# Altium project 1.蓝牙小车大工程.PrjPCB
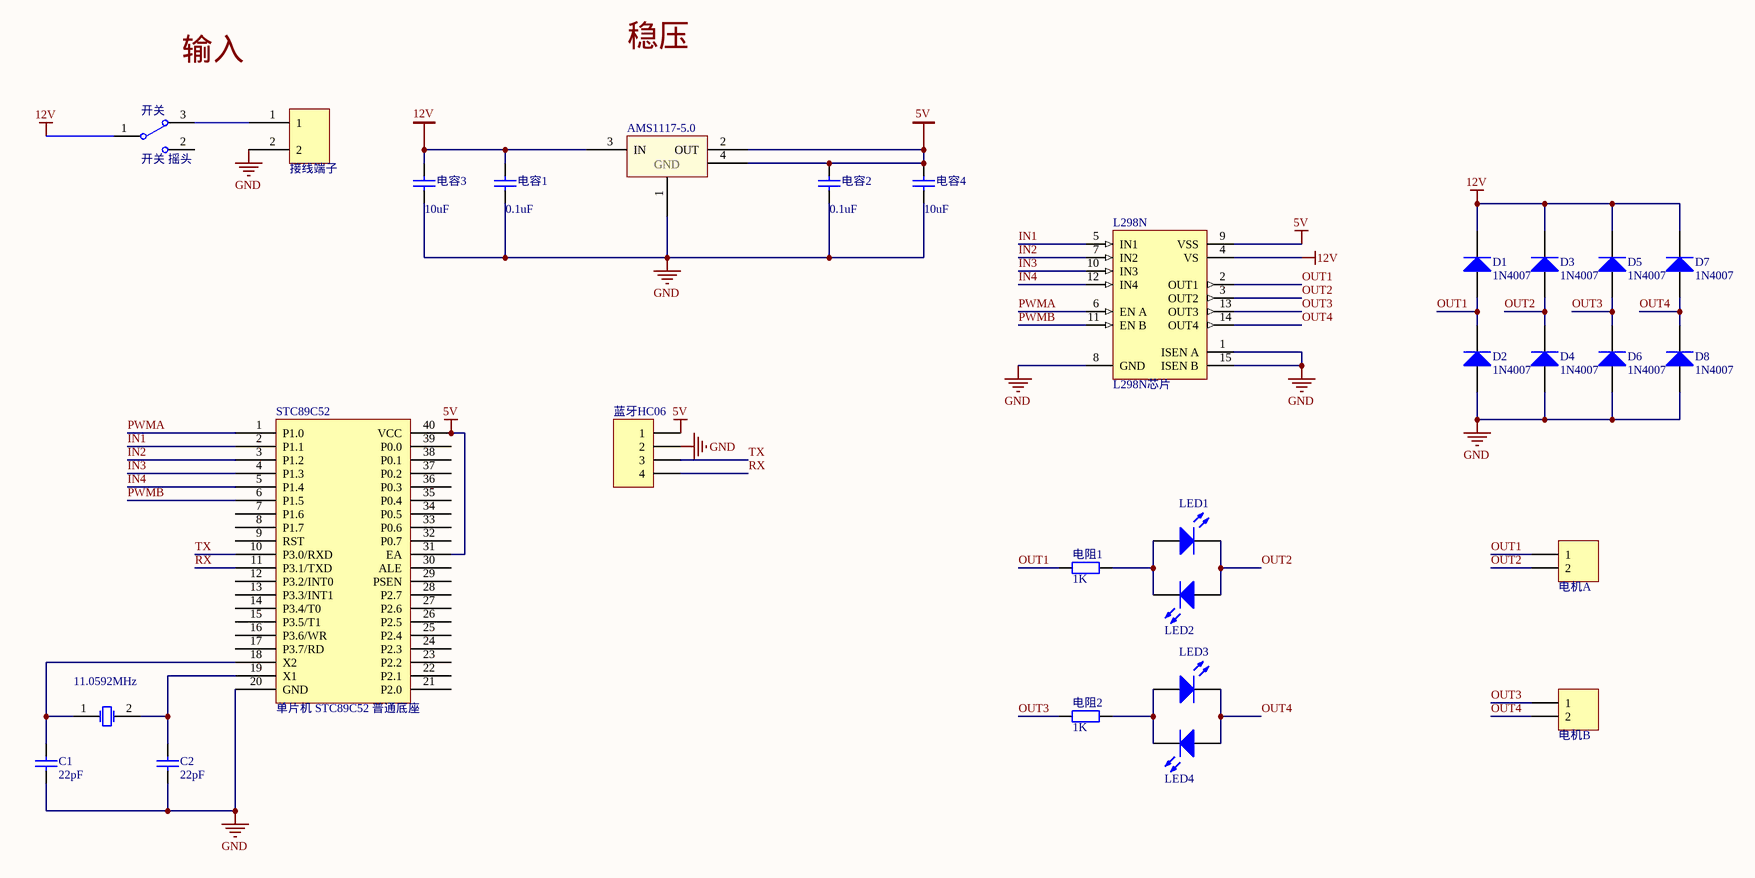
[diagram p0: 2.蓝牙小车原理图.SchDoc]
1 sheet, 29 parts. Net scope: global (net labels, ports and power ports of the same name join across sheets).
Board file: 3.蓝牙小车封装图.PcbDoc

## Sheet 2.蓝牙小车原理图.SchDoc
size A3

### Parts
AMS1117-5.0  稳压芯片 AMS1117  [稳压芯片 AMS1117]  (value not drawn)
C1  22pF  [电容 无极 贴片 0805]
C2  22pF  [电容 无极 贴片 0805]
D1  1N4007  [二极管 4007整流]
D2  1N4007  [二极管 4007整流]
D3  1N4007  [二极管 4007整流]
D4  1N4007  [二极管 4007整流]
D5  1N4007  [二极管 4007整流]
D6  1N4007  [二极管 4007整流]
D7  1N4007  [二极管 4007整流]
D8  1N4007  [二极管 4007整流]
L298N  L298N芯片  [L298N芯片]
LED1  LED 灯直径5mm  [LED 灯直径5mm]  (value not drawn)
LED2  LED 灯直径5mm  [LED 灯直径5mm]  (value not drawn)
LED3  LED 灯直径5mm  [LED 灯直径5mm]  (value not drawn)
LED4  LED 灯直径5mm  [LED 灯直径5mm]  (value not drawn)
STC89C52  单片机 STC89C52 普通底座  [单片机 STC89C52 普通底座]
开关  开关 摇头  [开关 摇头]
接线端子  接线端子 小号 蓝色 2引脚  [接线端子 小号 蓝色 2引脚]  (value not drawn)
晶振  11.0592MHz  [晶振 插件]
电容1  0.1uF  [电容 无极 贴片 0805]
电容2  0.1uF  [电容 无极 贴片 0805]
电容3  10uF  [电容 无极 贴片 0805]
电容4  10uF  [电容 无极 贴片 0805]
电机A  插针 1*2  [插针 1*2]  (value not drawn)
电机B  插针 1*2  [插针 1*2]  (value not drawn)
电阻1  1K  [电阻 贴片 0805]
电阻2  1K  [电阻 贴片 0805]
蓝牙HC06  (no value)  [排座 1*4]

### Nets
5V: AMS1117-5.0.2(OUT) AMS1117-5.0.4(OUT) L298N.9(VSS) STC89C52.31(EA) STC89C52.40(VCC) 电容2.2 电容4.2 蓝牙HC06.1
12V: AMS1117-5.0.3(IN) D1.2(K) D3.2(K) D5.2(K) D7.2(K) L298N.4(VS) 开关.1 电容1.2 电容3.2
GND: AMS1117-5.0.1 C1.1 C2.1 D2.1(A) D4.1(A) D6.1(A) D8.1(A) L298N.1(ISEN_A) L298N.8(GND) L298N.15(ISEN_B) STC89C52.20(GND) 接线端子.2 电容1.1 电容2.1 电容3.1 电容4.1 蓝牙HC06.2
IN1: L298N.5(IN1) STC89C52.2(P1.1)
IN2: L298N.7(IN2) STC89C52.3(P1.2)
IN3: L298N.10(IN3) STC89C52.4(P1.3)
IN4: L298N.12(IN4) STC89C52.5(P1.4)
OUT1: D1.1(A) D2.2(K) L298N.2(OUT1) 电机A.1 电阻1.1
OUT2: D3.1(A) D4.2(K) L298N.3(OUT2) LED1.2(K) LED2.1(A) 电机A.2
OUT3: D5.1(A) D6.2(K) L298N.13(OUT3) 电机B.1 电阻2.1
OUT4: D7.1(A) D8.2(K) L298N.14(OUT4) LED3.2(K) LED4.1(A) 电机B.2
PWMA: L298N.6(EN_A) STC89C52.1(P1.0)
PWMB: L298N.11(EN_B) STC89C52.6(P1.5)
RX: STC89C52.11(P3.1/TXD) 蓝牙HC06.4
TX: STC89C52.10(P3.0/RXD) 蓝牙HC06.3
NetC1_2: C1.2 STC89C52.18(X2) 晶振.1(OSC1)
NetC2_2: C2.2 STC89C52.19(X1) 晶振.2(OSC2)
NetLED1_1: LED1.1(A) LED2.2(K) 电阻1.2
NetLED3_1: LED3.1(A) LED4.2(K) 电阻2.2
Net开关_3: 开关.3 接线端子.1

Not connected (* = marked no-connect by the designer): STC89C52 7(P1.6) 8(P1.7) 9(RST) 12(P3.2/INT0) 13(P3.3/INT1) 14(P3.4/T0) 15(P3.5/T1) 16(P3.6/WR) 17(P3.7/RD) 21(P2.0) 22(P2.1) 23(P2.2) 24(P2.3) 25(P2.4) 26(P2.5) 27(P2.6) 28(P2.7) 29(PSEN) 30(ALE) 32(P0.7) 33(P0.6) 34(P0.5) 35(P0.4) 36(P0.3) 37(P0.2) 38(P0.1) 39(P0.0); 开关 2

### Notes on the sheet
- Labels drawn without touching a wire or pin: 稳压, 输入
- (in symbol 稳压芯片 AMS1117) GND

### Library data of the parts
C1 C2 电容1-电容4 = 电容 无极 贴片 0805
D1-D8 = 二极管
晶振 = 晶振 插件
电阻1 电阻2 = 电阻 贴片 0805
蓝牙HC06 = 排座 1*4